# Altium schematic sheet Driver6.SchDoc
size A4; SheetNumber: 8; SheetTotal: 8
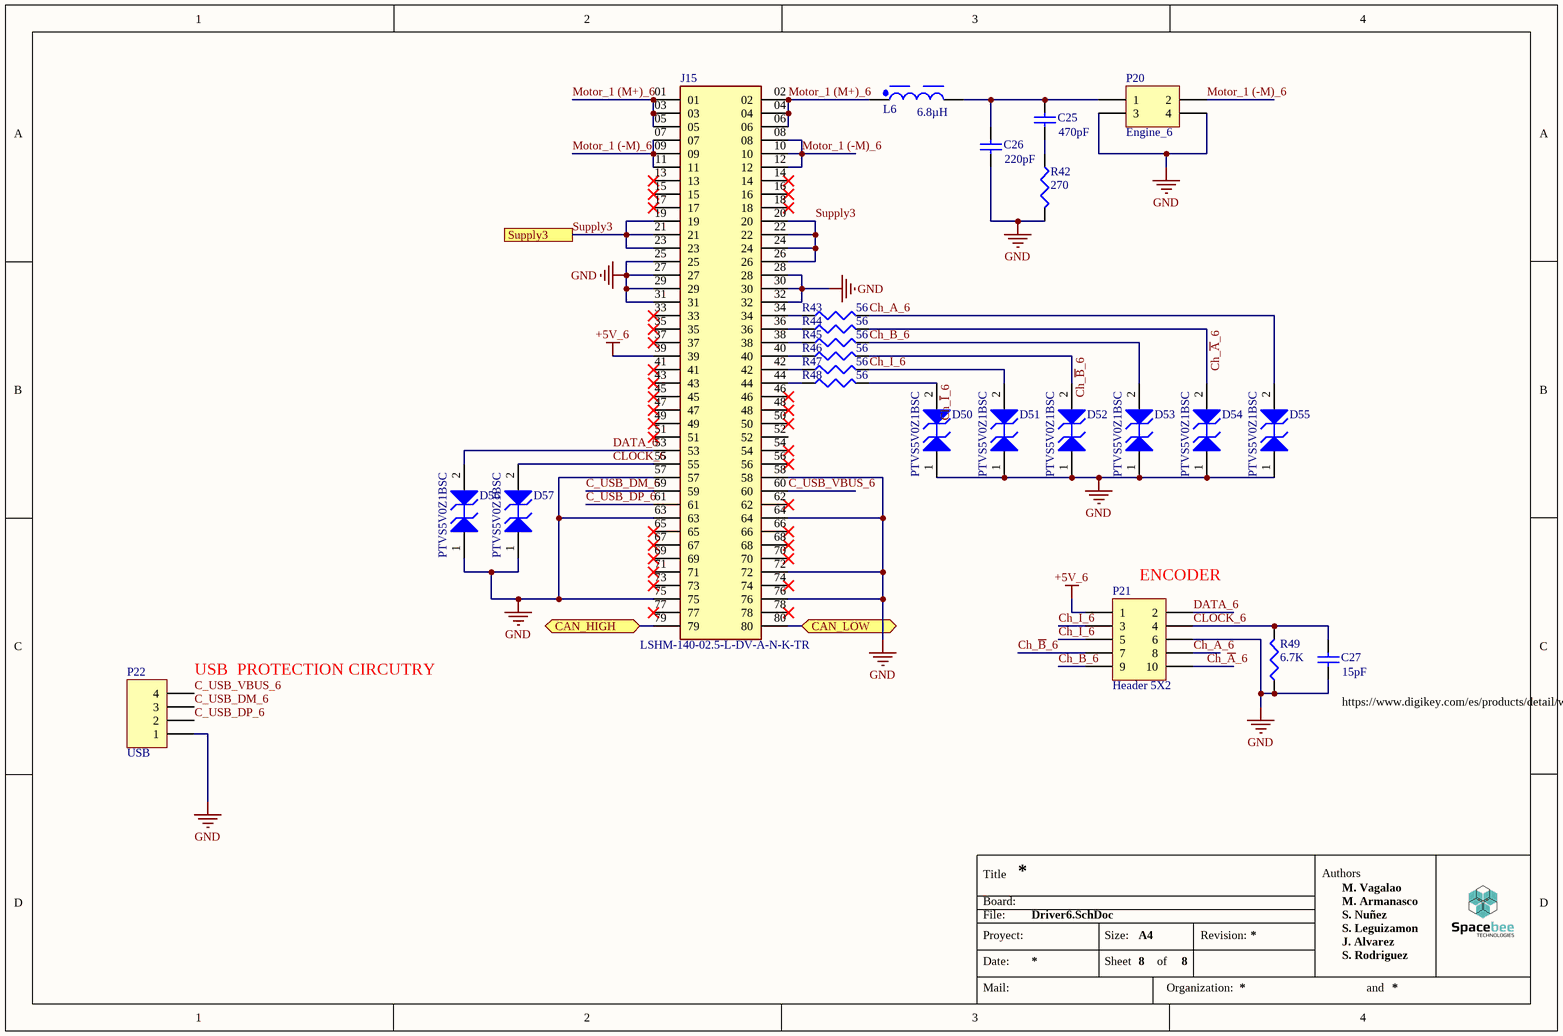
[diagram p0: Driver6.SchDoc]

## Parts
C25  value 470pF  [1608[0603]]  (hidden comment: Cap Semi)
C26  value 220pF  [1608[0603]]  (hidden comment: Cap Semi)
C27  value 15pF  [1608[0603]]  (hidden comment: Cap Semi)
D50  PTVS5V0Z1BSC  [SOD993B]
D51  PTVS5V0Z1BSC  [SOD993B]
D52  PTVS5V0Z1BSC  [SOD993B]
D53  PTVS5V0Z1BSC  [SOD993B]
D54  PTVS5V0Z1BSC  [SOD993B]
D55  PTVS5V0Z1BSC  [SOD993B]
D56  PTVS5V0Z1BSC  [SOD993B]
D57  PTVS5V0Z1BSC  [SOD993B]
J15  LSHM-140-02.5-L-DV-A-N-K-TR  [SAMTEC_LSHM-140-02.5-L-DV-A-N-K-TR]
L6  6.8µH  [WE-XHMA_6060]
P20  Engine_6  [MOLEX_1724480004]
P21  Header 5X2  [CONN_HIF3FC-14PA-2.54DS(71)_HIR]
P22  USB  [HDR1X4]
R42  value 270  [J1-0603]  (hidden comment: Res3)
R43  value 56  [J1-0603]  (hidden comment: Res3)
R44  value 56  [J1-0603]  (hidden comment: Res3)
R45  value 56  [J1-0603]  (hidden comment: Res3)
R46  value 56  [J1-0603]  (hidden comment: Res3)
R47  value 56  [J1-0603]  (hidden comment: Res3)
R48  value 56  [J1-0603]  (hidden comment: Res3)
R49  value 6.7K  [J1-0603]  (hidden comment: Res3)

## Ports
CAN_HIGH (bidir), CAN_LOW (bidir), Supply3

## Nets
+5V_6: J15.39 P21.1
GND: C26.2 C27.2 D50.1(A1) D51.1(A1) D52.1(A1) D53.1(A1) D54.1(A1) D55.1(A1) D56.1(A1) D57.1(A1) J15.25 J15.27 J15.28 J15.29 J15.30 J15.31 J15.32 J15.57 J15.58 J15.63 J15.64 J15.72 J15.75 J15.76 P20.3 P20.4 P21.6 P22.1 R42.2 R49.1
C_USB_DM_6: J15.59 P22.3
C_USB_DP_6: J15.61 P22.2
C_USB_VBUS_6: J15.60 P22.4
CAN_HIGH: J15.79 ; port CAN_HIGH
CAN_LOW: J15.80 ; port CAN_LOW
Ch_~{A}_6: D54.2(A2) P21.10 R44.2
Ch_A_6: D55.2(A2) P21.8 R43.2
Ch_~{B}_6: D52.2(A2) P21.7 R46.2
Ch_B_6: D53.2(A2) P21.9 R45.2
Ch_~{I}_6: D50.2(A2) P21.3 R48.2
Ch_I_6: D51.2(A2) P21.5 R47.2
CLOCK_6: C27.1 D57.2(A2) J15.55 P21.4 R49.2
DATA_6: D56.2(A2) J15.53 P21.2
Motor_1 (-M)_6: J15.07 J15.08 J15.09 J15.10 J15.11 J15.12 P20.2
Motor_1 (M+)_6: J15.01 J15.02 J15.03 J15.04 J15.05 J15.06 L6.1
Supply3: J15.19 J15.20 J15.21 J15.22 J15.23 J15.24 J15.26 ; port Supply3
NetC25_1: C25.1 C26.1 L6.2 P20.1
NetC25_2: C25.2 R42.1
NetJ15_34: J15.34 R43.1
NetJ15_36: J15.36 R44.1
NetJ15_38: J15.38 R45.1
NetJ15_40: J15.40 R46.1
NetJ15_42: J15.42 R47.1
NetJ15_44: J15.44 R48.1

Not connected (* = marked no-connect by the designer): J15 13* 14* 15* 16* 17* 18* 33* 35* 37* 41* 43* 45* 46* 47* 48* 49* 50* 51* 52 54* 56* 62* 65* 66* 67* 68* 69* 70* 71* 73* 74* 77* 78*

## Notes on the sheet
- (near P21) ENCODER
- (near P22) USB  PROTECTION CIRCUTRY
- (near C27) https://www.digikey.com/es/products/detail/würth-elektronik/9774050243R/5320640?s=N4IgTCBcDaIJwHYEBYAMBWVZkGYBKIAugL5A
- Title
- Board:
- File:
- Authors
- M. Armanasco
- S. Nuñez
- M. Vagalao
- Proyect:
- Date:
- Mail:
- Size:
- Sheet
- A4
- of
- Organization:
- Revision:
- S. Rodriguez
- S. Leguizamon
- J. Alvarez
- and

## Library data of the parts
C25-C27 = Cap Semi: Capacitor (Semiconductor SIM Model); Published: 8-Jun-2000; LatestRevisionDate: 29-May-2009; LatestRevisionNote: IPC-7351 Footprint Added.; PackageReference: C1206; Publisher: Altium Limited; PackageDescription: Chip Capacitor
D50-D57 = PTVS5V0Z1BSC: Manufacturer: On Semiconductor; PartNumber: 1SMB16CAT3; Direction: Bidirectional; IR Max (uA): 5; Packing: Tape and Reel; PPK Max (W): 600; V(BR) Typ (V): 18.74; DatasheetVersion: Rev. A; PackageVersion: Rev. A, 01/2000; PackageReference: SMB-2-403C-01; PackageDescription: 2-Pin Small Molded Package, J-Bend Lead, Body 4.315 x 3.555 mm; Supplier 1: Digi-Key; Supplier Part Number 1: 1SMB16CAT3OSTR-ND; Supplier 2: Digi-Key; Supplier Part Number 2: 1SMB16CAT3OSCT-ND; Supplier 3: Digi-Key; Supplier Part Number 3: 1SMB16CAT3OSDKR-ND; Mounting Technology: Surface Mount; ComponentLink1Description: Manufacturer URL; ComponentLink1URL: http://www.onsemi.com/; ComponentLink2Description: Datasheet; ComponentLink2URL: http://www.onsemi.com/pub_link/Collateral/1SMB10CAT3-D.PDF; ComponentLink3Description: Package Specification; ComponentLink3URL: http://www.onsemi.com/pub_link/Collateral/1SMB10CAT3-D.PDF
J15 = LSHM-140-02.5-L-DV-A-N-K-TR: LSHM - Samtec 0.50mm Razor Beam High-Speed Hermaphroditic Terminal / Socket Strip.; Price: None; MP: LSHM-140-02.5-L-DV-A-N-K-TR; Availability: Unavailable; Value: *; Package: None
L6 = 78439369068: WE-XHMA SMD Power Inductor, size 1090, 6.8µH, 10.5A, 7.16mΩ; Manufacturer: Wurth Elektronik; Case/Size Code: 1090; Inductance Tolerance: 20%; Saturation Current: 23.25A; Self Resonant Frequency: 16MHz; ComponentLink1Description: Website Link; ComponentLink1URL: https://www.we-online.com/redexpert/article/78439369068?ad; ComponentLink2Description: Datasheet Link; ComponentLink2URL: https://www.we-online.com/redexpert/spec/78439369068?ad; Manufacturer Part Number: 78439369068; Category: Shielded Power Inductors; Match Code: WE-XHMA; Mount: Surface Mount; Operating Temperature Max: 125°C; Operating Temperature Min: -40°C; Packaging: Tape and Reel; Length: 11.6mm; Width: 10.5mm; Height: 8.8mm; DC Resistance: 7.16mΩ; Inductance: 6.8µH; Rated Current: 10.5A
P20 = Header 2X2: Header, 2-Pin, Dual row; LatestRevisionDate: 17-Jul-2002; LatestRevisionNote: Re-released for DXP Platform.; Publisher: Altium Limited
P21 = Header 5X2: Header, 5-Pin, Dual row; LatestRevisionDate: 17-Jul-2002; LatestRevisionNote: Re-released for DXP Platform.; Publisher: Altium Limited
P22 = Header 4: Header, 4-Pin; LatestRevisionDate: 17-Jul-2002; LatestRevisionNote: Re-released for DXP Platform.; Publisher: Altium Limited
R42-R49 = Res3: Resistor; Published: 8-Jun-2000; LatestRevisionDate: 29-May-2009; LatestRevisionNote: IPC-7351 Footprint Added.; PackageReference: J1-0603; Publisher: Altium Limited; PackageDescription: Chip Resistor